# Altium project ControllorBord.PrjPcb
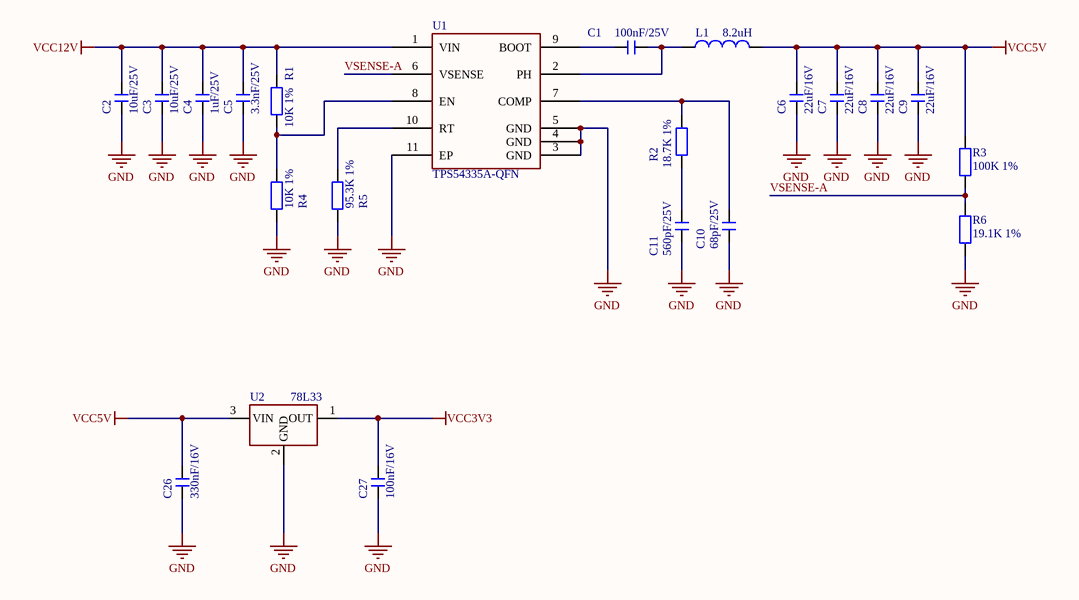
[diagram p0: PWR.SchDoc]
3 sheets, 72 parts. Net scope: global (net labels, ports and power ports of the same name join across sheets).
Board file: PCB.PcbDoc
Sheets:
  PWR.SchDoc
  MCU.SchDoc
  Connector.SchDoc

## Sheet PWR.SchDoc
size A4; SheetNumber: 1; SheetTotal: 3

### Parts
C1  100nF/25V  [C0603_L]
C2  10uF/25V  [C0603_L]
C3  10uF/25V  [C0603_L]
C4  1uF/25V  [C0603_L]
C5  3.3nF/25V  [C0603_L]
C6  22uF/16V  [C0603_L]
C7  22uF/16V  [C0603_L]
C8  22uF/16V  [C0603_L]
C9  22uF/16V  [C0603_L]
C10  68pF/25V  [C0603_L]
C11  560pF/25V  [C0603_L]
C26  330nF/16V  [C0603_L]
C27  100nF/16V  [C0603_L]
L1  8.2uH  [NR4020]
R1  10K 1%  [R0603_L]
R2  18.7K 1%  [R0603_L]
R3  100K 1%  [R0603_L]
R4  10K 1%  [R0603_L]
R5  95.3K 1%  [R0603_L]
R6  19.1K 1%  [R0603_L]
U1  TPS54335A-QFN  [VSON-10_L3.0-W3.0-P0.50-TL-EP]
U2  78L33  [SOT89_L]

### Nets
GND: C2.1 C3.1 C4.1 C5.1 C6.1 C7.1 C8.1 C9.1 C10.1 C11.1 C26.1 C27.1 R4.2 R5.2 R6.2 U1.3(GND) U1.4(GND) U1.5(GND) U1.11(EP) U2.2(GND)
VCC3V3: C27.2 U2.1(OUT)
VCC5V: C6.2 C7.2 C8.2 C9.2 C26.2 L1.2 R3.1 U2.3(VIN)
VCC12V: C2.2 C3.2 C4.2 C5.2 R1.1 U1.1(VIN)
VSENSE-A: R3.2 R6.1 U1.6(VSENSE)
NetC1_1: C1.1 L1.1 U1.2(PH)
NetC1_2: C1.2 U1.9(BOOT)
NetC10_2: C10.2 R2.1 U1.7(COMP)
NetC11_2: C11.2 R2.2
NetR1_2: R1.2 R4.1 U1.8(EN)
NetR5_1: R5.1 U1.10(RT)

### Library data of the parts
C1-C11 C26 C27 = C: 无极性贴片电容; 版权归属: 源创客; 材质: X7R; BOM名称: 无极性贴片电容; 学习资源: www.ooocke.com
L1 = L: 小功率贴片电感; 版权归属: 源创客; BOM名称: 小功率贴片电感; 学习资源: www.ooocke.com
R1-R6 = R: 贴片电阻; 版权归属: 源创客; BOM名称: 贴片电阻; 学习资源: www.ooocke.com
U1 = TPS54335A-QFN: BUCK

## Sheet MCU.SchDoc
size A3; SheetNumber: 2; SheetTotal: 3
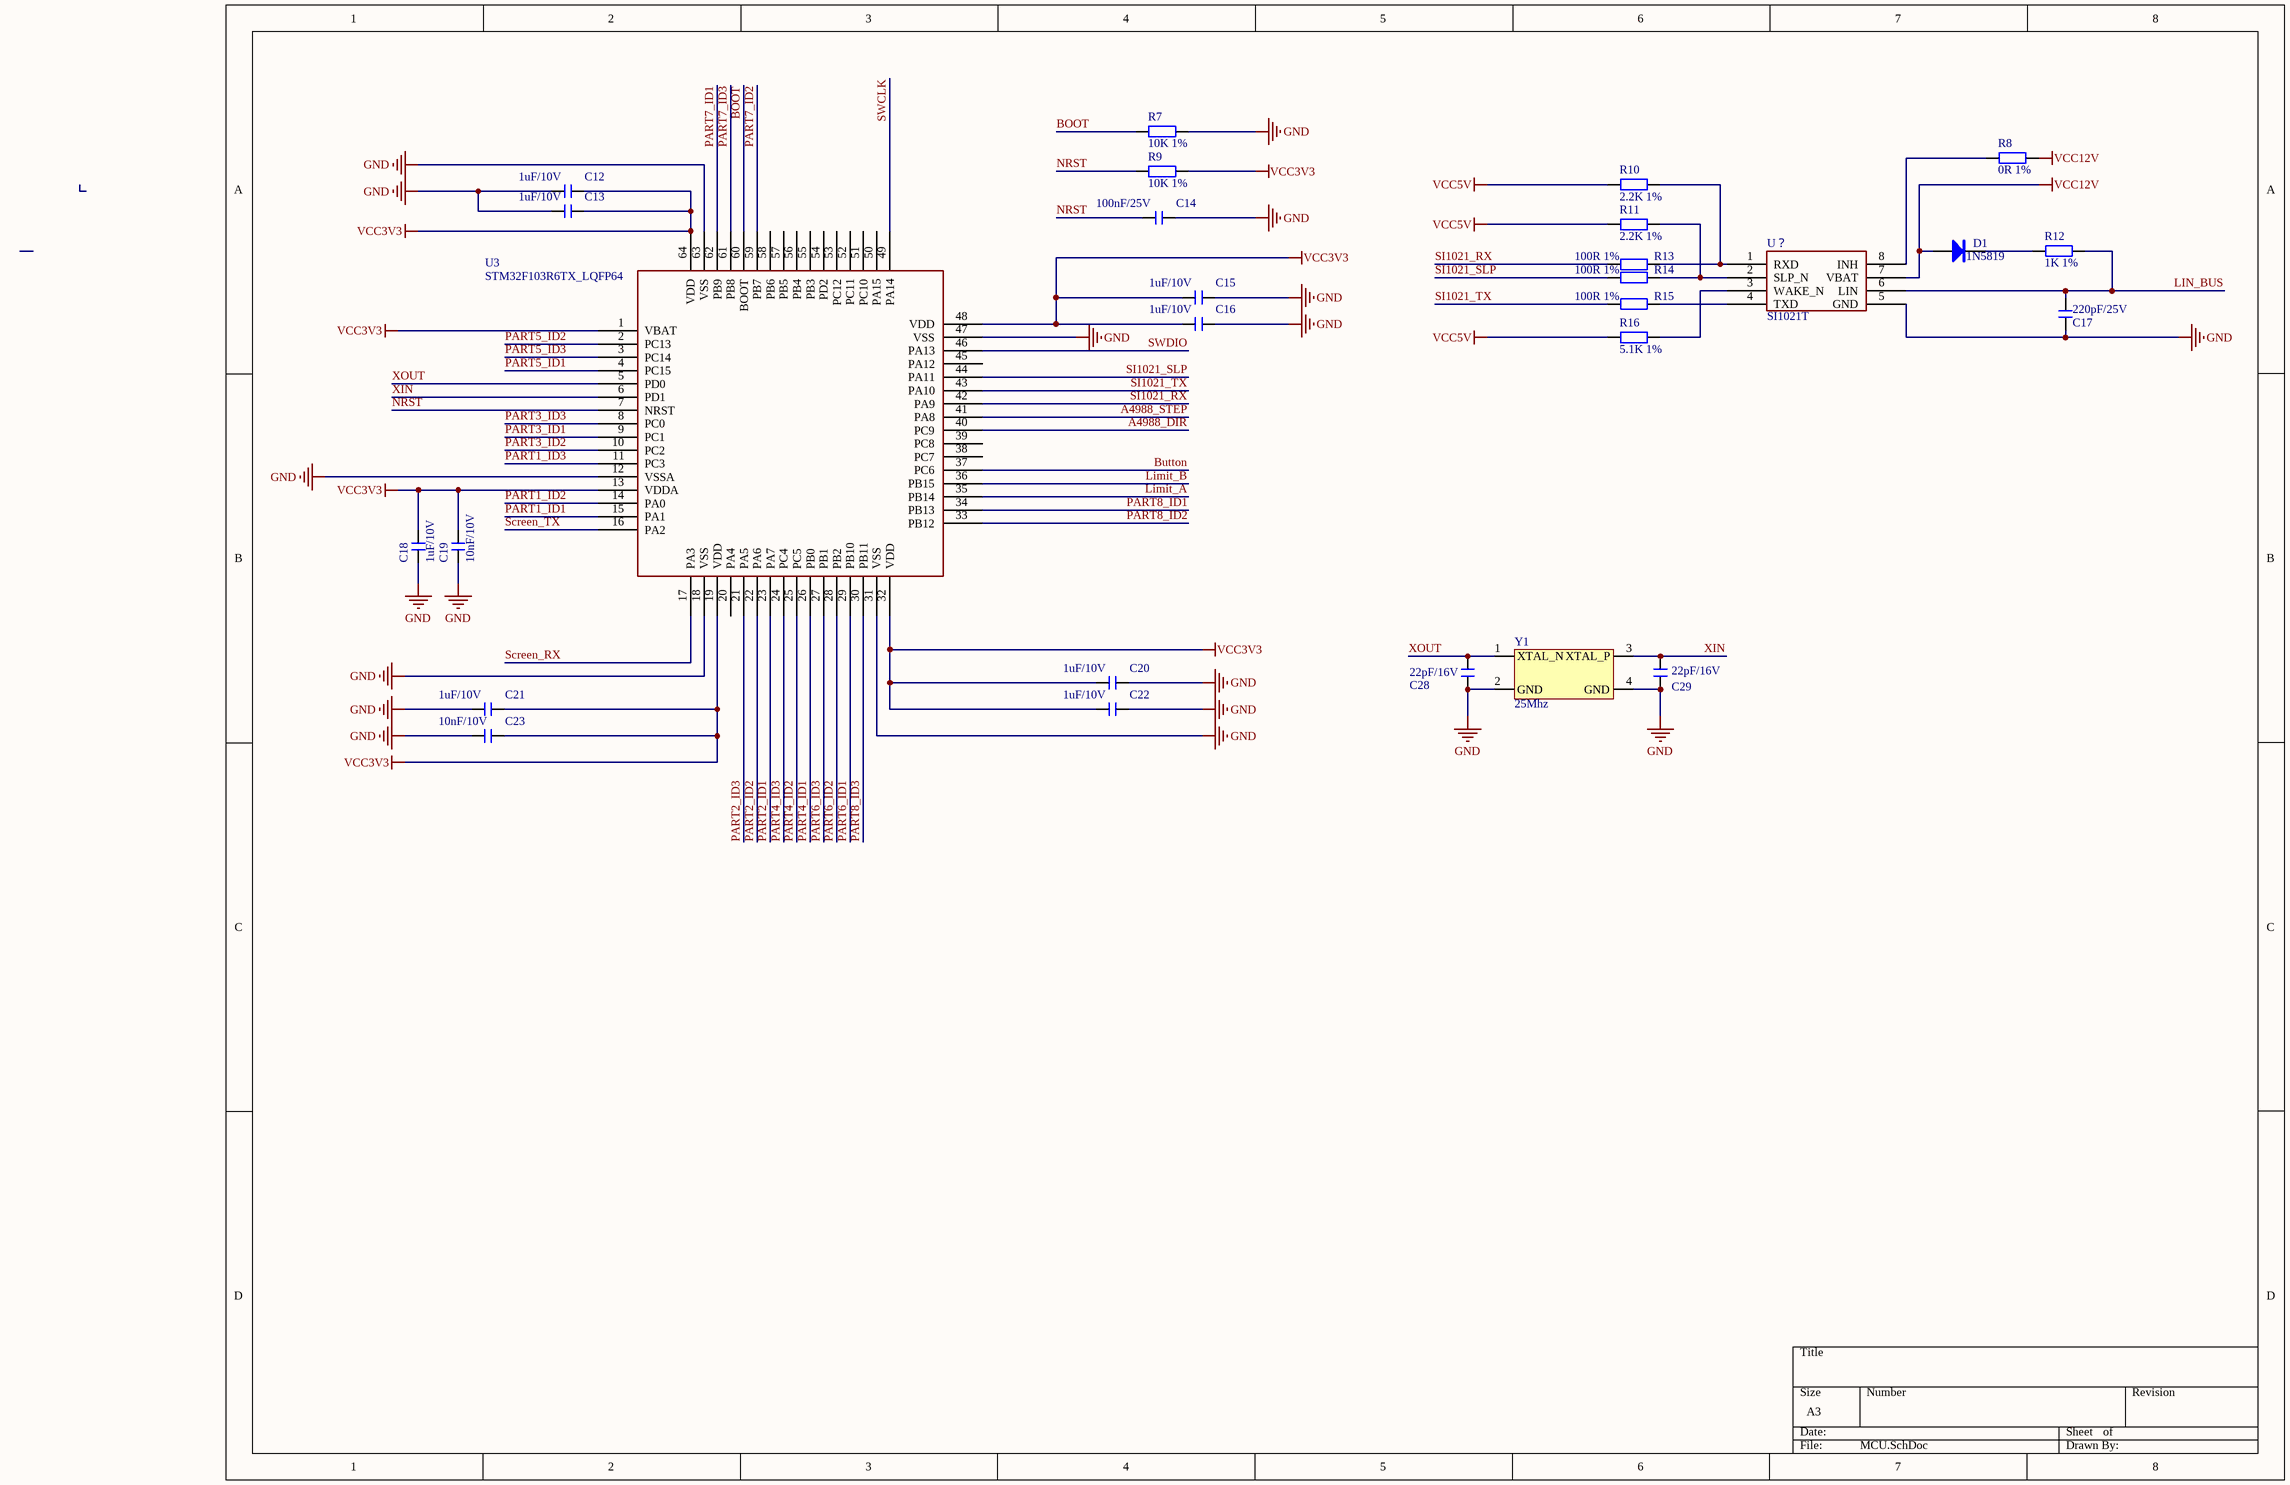
[diagram p1: MCU.SchDoc]

### Parts
C12  1uF/10V  [C0603_L]
C13  1uF/10V  [C0603_L]
C14  100nF/25V  [C0603_L]
C15  1uF/10V  [C0603_L]
C16  1uF/10V  [C0603_L]
C17  220pF/25V  [C0603_L]
C18  1uF/10V  [C0603_L]
C19  10nF/10V  [C0603_L]
C20  1uF/10V  [C0603_L]
C21  1uF/10V  [C0603_L]
C22  1uF/10V  [C0603_L]
C23  10nF/10V  [C0603_L]
C28  22pF/16V  [C0402_L]
C29  22pF/16V  [C0402_L]
D1  1N5819  [SOD-323]
R7  10K 1%  [R0603_L]
R8  0R 1%  [R0603_L]
R9  10K 1%  [R0603_L]
R10  2.2K 1%  [R0603_L]
R11  2.2K 1%  [R0603_L]
R12  1K 1%  [R0603_L]
R13  100R 1%  [R0603_L]
R14  100R 1%  [R0603_L]
R15  100R 1%  [R0603_L]
R16  5.1K 1%  [R0603_L]
U3  STM32F103R6TX_LQFP64  [LQFP64 10x10_N]
U？  SI1021T  [SOP8]
Y1  25Mhz  [OSC 3225-4P]

### Nets
GND: C12.2 C13.2 C14.1 C15.1 C16.1 C17.1 C18.1 C19.1 C20.1 C21.2 C22.1 C23.2 C28.2 C29.2 R7.2 U3.12(VSSA) U3.18(VSS) U3.31(VSS) U3.47(VSS) U3.63(VSS) U？.5(GND) Y1.2(GND) Y1.4(GND)
VCC3V3: C12.1 C13.1 C15.2 C16.2 C18.2 C19.2 C20.2 C21.1 C22.2 C23.1 R9.2 U3.1(VBAT) U3.13(VDDA) U3.19(VDD) U3.32(VDD) U3.48(VDD) U3.64(VDD)
VCC5V: R10.2 R11.2 R16.2
VCC12V: D1.1(A) R8.1 U？.7(VBAT)
A4988_DIR: U3.40(PC9)
A4988_STEP: U3.41(PA8)
BOOT: R7.1 U3.60(BOOT)
Button: U3.37(PC6)
Limit_A: U3.35(PB14)
Limit_B: U3.36(PB15)
LIN_BUS: C17.2 R12.1 U？.6(LIN)
NRST: C14.2 R9.1 U3.7(NRST)
PART1_ID1: U3.15(PA1)
PART1_ID2: U3.14(PA0)
PART1_ID3: U3.11(PC3)
PART2_ID1: U3.23(PA7)
PART2_ID2: U3.22(PA6)
PART2_ID3: U3.21(PA5)
PART3_ID1: U3.9(PC1)
PART3_ID2: U3.10(PC2)
PART3_ID3: U3.8(PC0)
PART4_ID1: U3.26(PB0)
PART4_ID2: U3.25(PC5)
PART4_ID3: U3.24(PC4)
PART5_ID1: U3.4(PC15)
PART5_ID2: U3.2(PC13)
PART5_ID3: U3.3(PC14)
PART6_ID1: U3.29(PB10)
PART6_ID2: U3.28(PB2)
PART6_ID3: U3.27(PB1)
PART7_ID1: U3.62(PB9)
PART7_ID2: U3.59(PB7)
PART7_ID3: U3.61(PB8)
PART8_ID1: U3.34(PB13)
PART8_ID2: U3.33(PB12)
PART8_ID3: U3.30(PB11)
Screen_RX: U3.17(PA3)
Screen_TX: U3.16(PA2)
SI1021_RX: R13.1 U3.42(PA9)
SI1021_SLP: R14.1 U3.44(PA11)
SI1021_TX: R15.1 U3.43(PA10)
SWCLK: U3.49(PA14)
SWDIO: U3.46(PA13)
XIN: C29.1 U3.6(PD1) Y1.3(XTAL_P)
XOUT: C28.1 U3.5(PD0) Y1.1(XTAL_N)
NetD1_2: D1.2(K) R12.2
NetR8_2: R8.2 U？.8(INH)
NetR10_1: R10.1 R13.2 U？.1(RXD)
NetR11_1: R11.1 R14.2 U？.2(SLP_N)
NetR15_2: R15.2 U？.4(TXD)
NetR16_1: R16.1 U？.3(WAKE_N)

Not connected (* = marked no-connect by the designer): U3 20(PA4) 38(PC7) 39(PC8) 45(PA12) 50(PA15) 51(PC10) 52(PC11) 53(PC12) 54(PD2) 55(PB3) 56(PB4) 57(PB5) 58(PB6)

### Library data of the parts
C12-C23 C28 C29 = C: 无极性贴片电容; 版权归属: 源创客; 材质: X7R; BOM名称: 无极性贴片电容; 学习资源: www.ooocke.com
D1 = 1N5819: 肖特基二极管; 版权归属: 源创客; 属性: 40V/2A; BOM名称: 肖特基二极管; 学习资源: www.ooocke.com
R7-R16 = R: 贴片电阻; 版权归属: 源创客; BOM名称: 贴片电阻; 学习资源: www.ooocke.com
U？ = SI1021T: SI1021T LIN收发器
Y1 = Crystal

## Sheet Connector.SchDoc
size A4; SheetNumber: 3; SheetTotal: 3
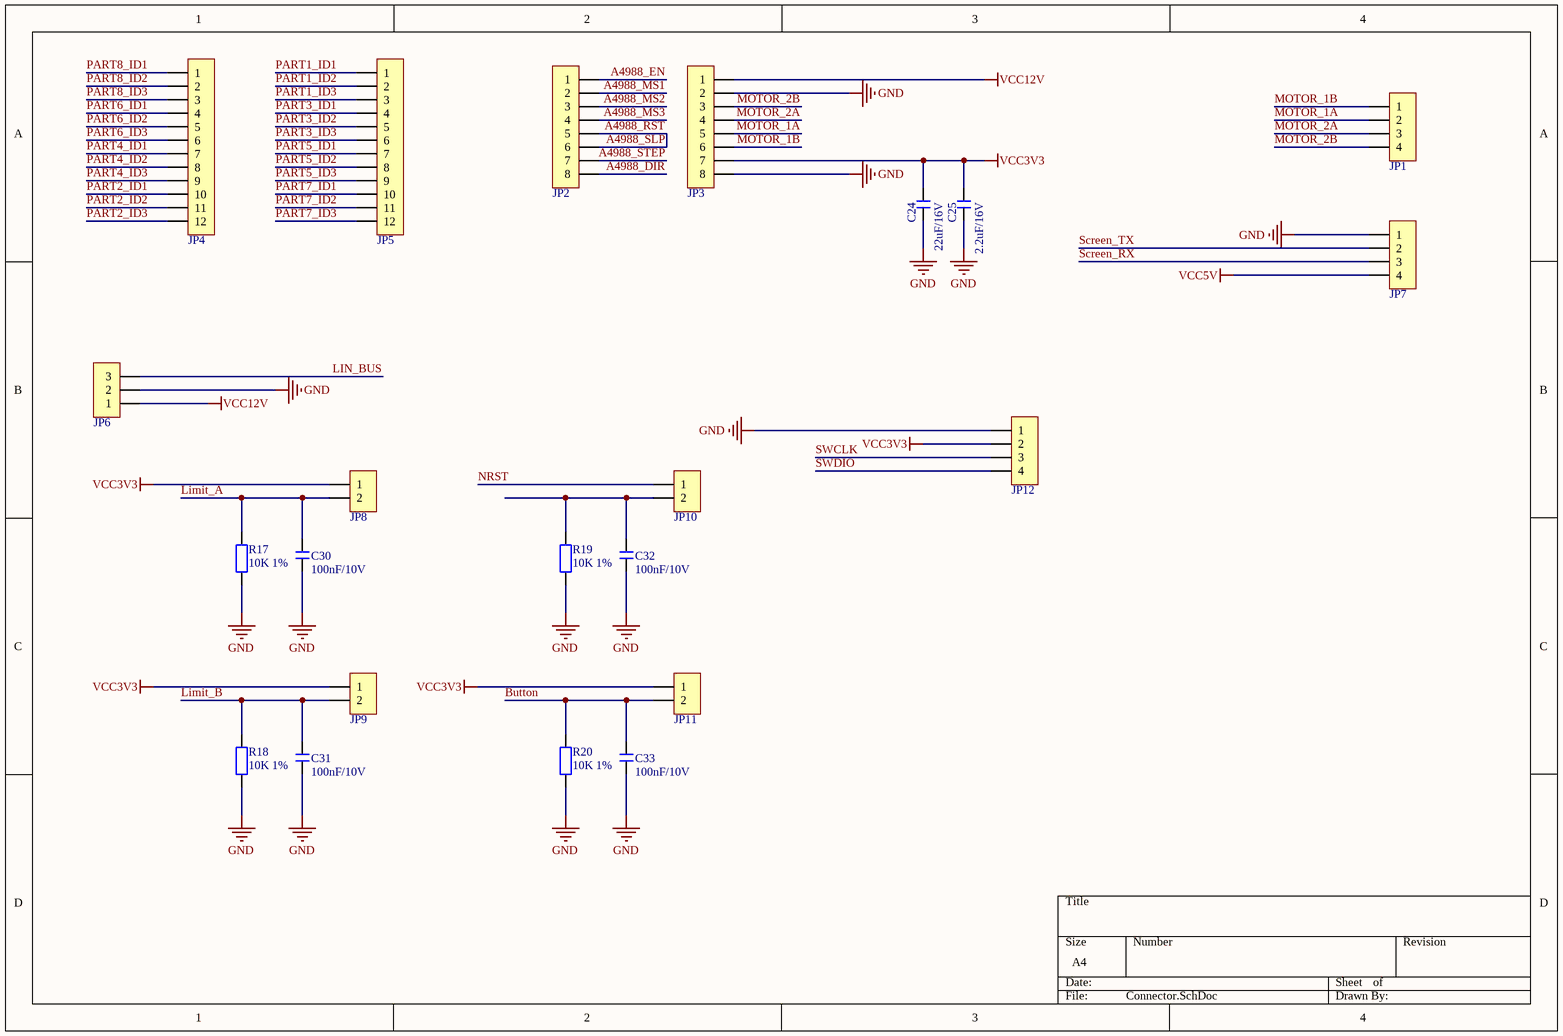
[diagram p2: Connector.SchDoc]

### Parts
C24  22uF/16V  [C0603_L]
C25  2.2uF/16V  [C0603_L]
C30  100nF/10V  [C0603_L]
C31  100nF/10V  [C0603_L]
C32  100nF/10V  [C0603_L]
C33  100nF/10V  [C0603_L]
JP1  HDR-1X4  [XH2.54-LI-4P]  (value not drawn)
JP2  HDR-1X8  [HDR2.54-M-LI-8P]  (value not drawn)
JP3  HDR-1X8  [HDR2.54-M-LI-8P]  (value not drawn)
JP4  HDR-1X12  [MX1.25-L-12P]  (value not drawn)
JP5  HDR-1X12  [MX1.25-L-12P]  (value not drawn)
JP6  HDR-1X3  [XH2.54-LI-3P]  (value not drawn)
JP7  HDR-1X4  [XH2.54-LI-4P]  (value not drawn)
JP8  HDR-1X2  [XH2.54-LI-2P]  (value not drawn)
JP9  HDR-1X2  [XH2.54-LI-2P]  (value not drawn)
JP10  HDR-1X2  [XH2.54-LI-2P]  (value not drawn)
JP11  HDR-1X2  [XH2.54-LI-2P]  (value not drawn)
JP12  HDR-1X4  [HDR2.54-LI-4P]  (value not drawn)
R17  10K 1%  [R0603_L]
R18  10K 1%  [R0603_L]
R19  10K 1%  [R0603_L]
R20  10K 1%  [R0603_L]

### Nets
GND: C24.1 C25.1 C30.2 C31.2 C32.2 C33.2 JP3.2 JP3.8 JP6.2 JP7.1 JP12.1 R17.2 R18.2 R19.2 R20.2
VCC3V3: C24.2 C25.2 JP3.7 JP8.1 JP9.1 JP11.1 JP12.2
VCC5V: JP7.4
VCC12V: JP3.1 JP6.1
A4988_DIR: JP2.8
A4988_EN: JP2.1
A4988_MS1: JP2.2
A4988_MS2: JP2.3
A4988_MS3: JP2.4
A4988_RST: JP2.5 JP2.6  [also labelled A4988_SLP]
A4988_STEP: JP2.7
Button: C33.1 JP11.2 R20.1
Limit_A: C30.1 JP8.2 R17.1
Limit_B: C31.1 JP9.2 R18.1
LIN_BUS: JP6.3
MOTOR_1A: JP1.2 JP3.5
MOTOR_1B: JP1.1 JP3.6
MOTOR_2A: JP1.3 JP3.4
MOTOR_2B: JP1.4 JP3.3
NRST: JP10.1
PART1_ID1: JP5.1
PART1_ID2: JP5.2
PART1_ID3: JP5.3
PART2_ID1: JP4.10
PART2_ID2: JP4.11
PART2_ID3: JP4.12
PART3_ID1: JP5.4
PART3_ID2: JP5.5
PART3_ID3: JP5.6
PART4_ID1: JP4.7
PART4_ID2: JP4.8
PART4_ID3: JP4.9
PART5_ID1: JP5.7
PART5_ID2: JP5.8
PART5_ID3: JP5.9
PART6_ID1: JP4.4
PART6_ID2: JP4.5
PART6_ID3: JP4.6
PART7_ID1: JP5.10
PART7_ID2: JP5.11
PART7_ID3: JP5.12
PART8_ID1: JP4.1
PART8_ID2: JP4.2
PART8_ID3: JP4.3
Screen_RX: JP7.3
Screen_TX: JP7.2
SWCLK: JP12.3
SWDIO: JP12.4
NetC32_1: C32.1 JP10.2 R19.1

### Library data of the parts
C24 C25 C30-C33 = C: 无极性贴片电容; 版权归属: 源创客; 材质: X7R; BOM名称: 无极性贴片电容; 学习资源: www.ooocke.com
JP1 JP7 JP12 = Header 4: 4P接插件; 版权归属: 源创客; BOM名称: 4P接插件; 学习资源: www.ooocke.com
JP2 JP3 = Header 8: 8P接插件; 版权归属: 源创客; BOM名称: 8P接插件; 学习资源: www.ooocke.com
JP4 JP5 = Header 12: 12P接插件; 版权归属: 源创客; BOM名称: 12P接插件; 学习资源: www.ooocke.com
JP6 = Header 3: 3P接插件; 版权归属: 源创客; BOM名称: 3P接插件; 学习资源: www.ooocke.com
JP8-JP11 = Header 2: 2P接插件; 版权归属: 源创客; BOM名称: 2P接插件; 学习资源: www.ooocke.com
R17-R20 = R: 贴片电阻; 版权归属: 源创客; BOM名称: 贴片电阻; 学习资源: www.ooocke.com

## Nets that join several sheets
GND: PWR (20 pins), MCU (23 pins), Connector (15 pins)
VCC3V3: PWR (C27.2 U2.1), MCU (17 pins), Connector (7 pins)
VCC5V: PWR (8 pins), MCU (R10.2 R11.2 R16.2), Connector (JP7.4)
VCC12V: PWR (6 pins), MCU (D1.1 R8.1 U？.7), Connector (JP3.1 JP6.1)
A4988_DIR: MCU (U3.40), Connector (JP2.8)
A4988_STEP: MCU (U3.41), Connector (JP2.7)
Button: MCU (U3.37), Connector (C33.1 JP11.2 R20.1)
Limit_A: MCU (U3.35), Connector (C30.1 JP8.2 R17.1)
Limit_B: MCU (U3.36), Connector (C31.1 JP9.2 R18.1)
LIN_BUS: MCU (C17.2 R12.1 U？.6), Connector (JP6.3)
NRST: MCU (C14.2 R9.1 U3.7), Connector (JP10.1)
PART1_ID1: MCU (U3.15), Connector (JP5.1)
PART1_ID2: MCU (U3.14), Connector (JP5.2)
PART1_ID3: MCU (U3.11), Connector (JP5.3)
PART2_ID1: MCU (U3.23), Connector (JP4.10)
PART2_ID2: MCU (U3.22), Connector (JP4.11)
PART2_ID3: MCU (U3.21), Connector (JP4.12)
PART3_ID1: MCU (U3.9), Connector (JP5.4)
PART3_ID2: MCU (U3.10), Connector (JP5.5)
PART3_ID3: MCU (U3.8), Connector (JP5.6)
PART4_ID1: MCU (U3.26), Connector (JP4.7)
PART4_ID2: MCU (U3.25), Connector (JP4.8)
PART4_ID3: MCU (U3.24), Connector (JP4.9)
PART5_ID1: MCU (U3.4), Connector (JP5.7)
PART5_ID2: MCU (U3.2), Connector (JP5.8)
PART5_ID3: MCU (U3.3), Connector (JP5.9)
PART6_ID1: MCU (U3.29), Connector (JP4.4)
PART6_ID2: MCU (U3.28), Connector (JP4.5)
PART6_ID3: MCU (U3.27), Connector (JP4.6)
PART7_ID1: MCU (U3.62), Connector (JP5.10)
PART7_ID2: MCU (U3.59), Connector (JP5.11)
PART7_ID3: MCU (U3.61), Connector (JP5.12)
PART8_ID1: MCU (U3.34), Connector (JP4.1)
PART8_ID2: MCU (U3.33), Connector (JP4.2)
PART8_ID3: MCU (U3.30), Connector (JP4.3)
Screen_RX: MCU (U3.17), Connector (JP7.3)
Screen_TX: MCU (U3.16), Connector (JP7.2)
SWCLK: MCU (U3.49), Connector (JP12.3)
SWDIO: MCU (U3.46), Connector (JP12.4)